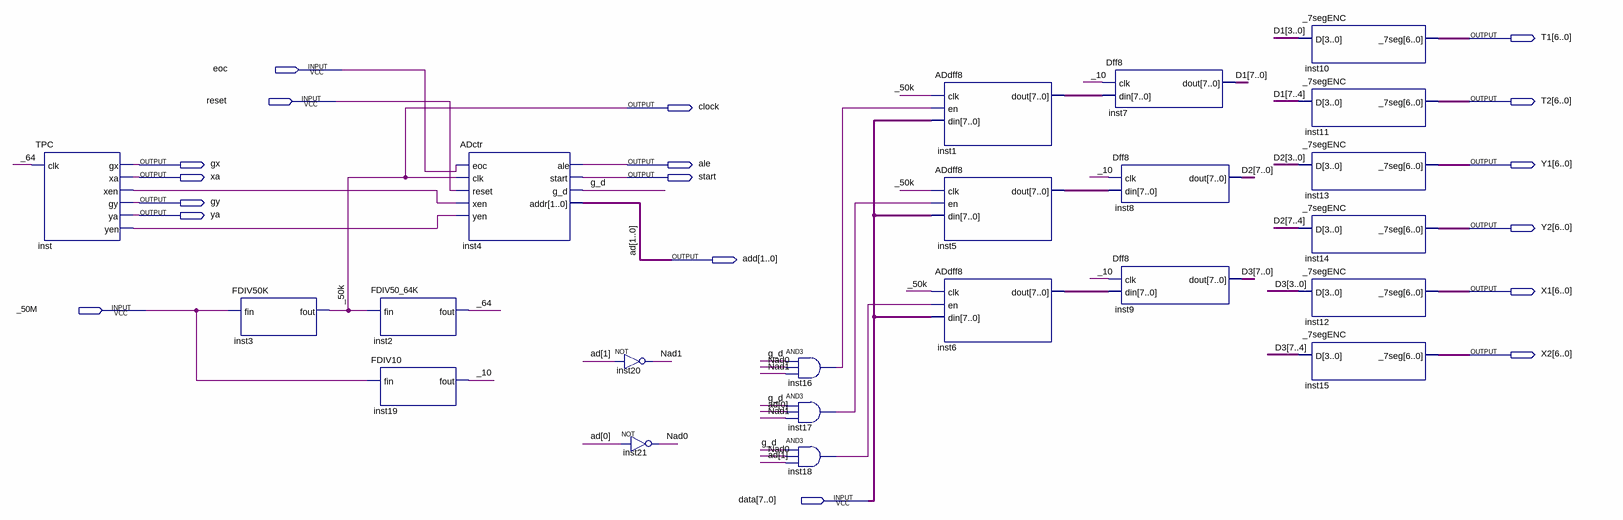
[diagram p0: schematic sheet]
// Quartus schematic hw7.bdf as structural Verilog: 22 symbols, 18 pins
module hw7 (
  input  eoc,
  input  reset,
  input  _50M,
  input  [7:0] data,
  output [6:0] T1,
  output [6:0] T2,
  output clock,
  output gx,
  output ale,
  output [6:0] Y1,
  output xa,
  output start,
  output gy,
  output ya,
  output [6:0] Y2,
  output [1:0] add,
  output [6:0] X1,
  output [6:0] X2
);

  wire _10, _64, g_d, inst16_out, inst17_out, inst18_out, inst_xen, inst_yen, Nad0, Nad1;
  wire [7:0] D1, D2, D3, inst1_dout, inst5_dout, inst6_dout;

  TPC inst (.clk(_64), .gx(gx), .xa(xa), .xen(inst_xen), .gy(gy), .ya(ya), .yen(inst_yen));
  FDIV50K inst3 (.fin(_50M), .fout(clock));
  FDIV50_64K inst2 (.fin(clock), .fout(_64));
  FDIV10 inst19 (.fin(_50M), .fout(_10));
  ADctr inst4 (
    .eoc(eoc), .clk(clock), .reset(reset), .xen(inst_xen), .yen(inst_yen), .ale(ale), .start(start),
    .g_d(g_d), .addr(add));
  not inst20 (Nad1, add[1]);
  not inst21 (Nad0, add[0]);
  and inst16 (inst16_out, g_d, Nad0, Nad1);
  and inst17 (inst17_out, g_d, add[0], Nad1);
  and inst18 (inst18_out, g_d, Nad0, add[1]);
  ADdff8 inst1 (.clk(clock), .en(inst16_out), .din(data), .dout(inst1_dout));
  ADdff8 inst5 (.clk(clock), .en(inst17_out), .din(data), .dout(inst5_dout));
  ADdff8 inst6 (.clk(clock), .en(inst18_out), .din(data), .dout(inst6_dout));
  Dff8 inst7 (.clk(_10), .din(inst1_dout), .dout(D1));
  Dff8 inst8 (.clk(_10), .din(inst5_dout), .dout(D2));
  Dff8 inst9 (.clk(_10), .din(inst6_dout), .dout(D3));
  _7segENC inst10 (.D(D1[3:0]), ._7seg(T1));
  _7segENC inst11 (.D(D1[7:4]), ._7seg(T2));
  _7segENC inst13 (.D(D2[3:0]), ._7seg(Y1));
  _7segENC inst14 (.D(D2[7:4]), ._7seg(Y2));
  _7segENC inst12 (.D(D3[3:0]), ._7seg(X1));
  _7segENC inst15 (.D(D3[7:4]), ._7seg(X2));

  // Other names for the same wires on the sheet: ad[1:0] = add; _50k = clock
endmodule
